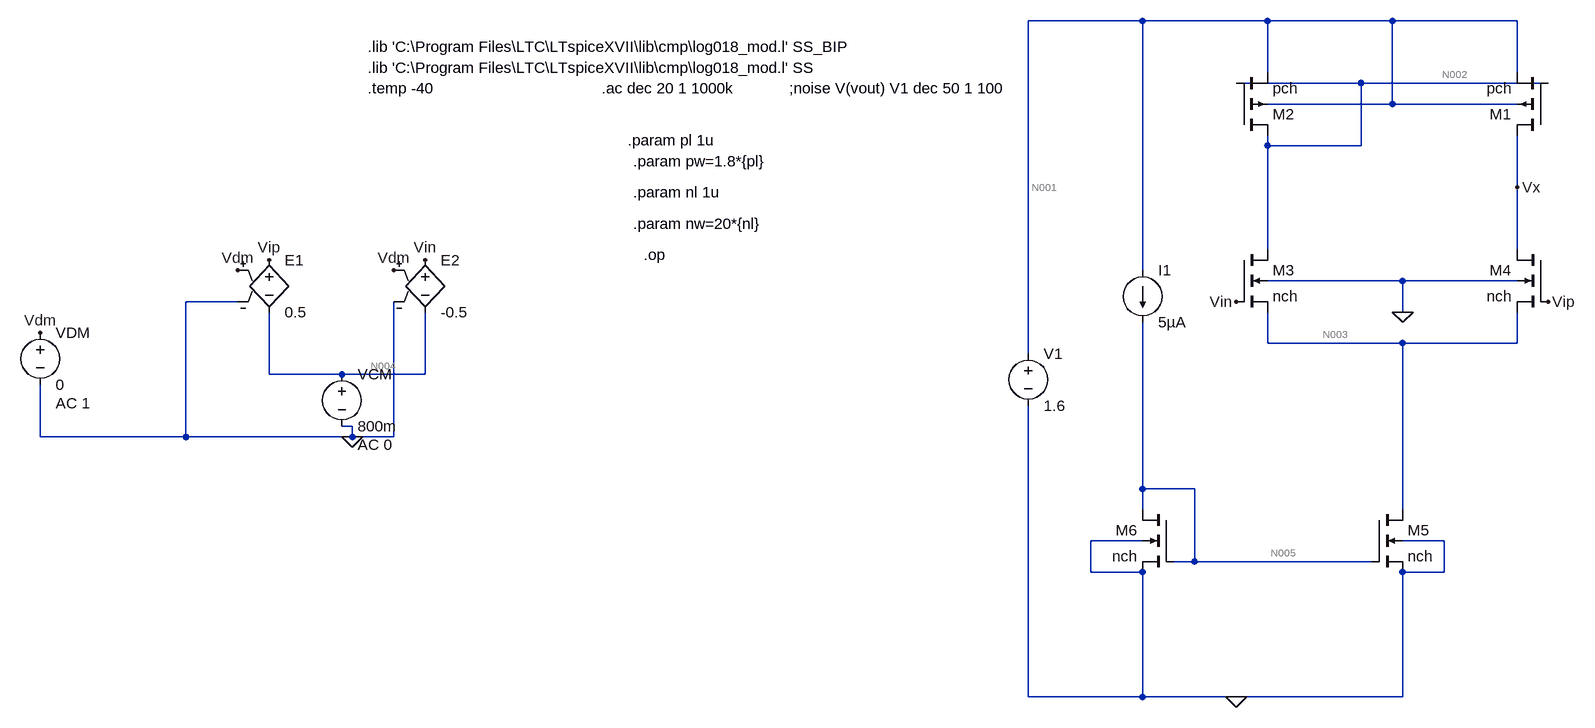
[diagram p0: schematic amplifier.asc]
amplifier.asc, the LTspice schematic file:
Version 4
SHEET 1 1880 836
WIRE -144 -224 -320 -224
WIRE 48 -224 -144 -224
WIRE 240 -224 48 -224
WIRE 432 -224 240 -224
WIRE 48 -144 48 -224
WIRE 432 -144 432 -224
WIRE 192 -128 0 -128
WIRE 480 -128 192 -128
WIRE 240 -96 240 -224
WIRE 240 -96 48 -96
WIRE 432 -96 240 -96
WIRE 48 -32 48 -48
WIRE 192 -32 192 -128
WIRE 192 -32 48 -32
WIRE 432 32 432 -48
WIRE 48 128 48 -32
WIRE 432 128 432 32
WIRE -144 160 -144 -224
WIRE 256 176 48 176
WIRE 432 176 256 176
WIRE -1536 208 -1616 208
WIRE 256 224 256 176
WIRE 48 272 48 224
WIRE 256 272 48 272
WIRE 432 272 432 224
WIRE 432 272 256 272
WIRE -320 288 -320 -224
WIRE -1488 320 -1488 224
WIRE -1376 320 -1488 320
WIRE -1248 320 -1248 224
WIRE -1248 320 -1376 320
WIRE -1360 400 -1376 400
WIRE -1840 416 -1840 336
WIRE -1616 416 -1616 208
WIRE -1616 416 -1840 416
WIRE -1360 416 -1360 400
WIRE -1360 416 -1616 416
WIRE -1296 416 -1296 208
WIRE -1296 416 -1360 416
WIRE -144 496 -144 240
WIRE -64 496 -144 496
WIRE -144 528 -144 496
WIRE 256 528 256 272
WIRE -144 576 -224 576
WIRE 320 576 256 576
WIRE -64 608 -64 496
WIRE -64 608 -96 608
WIRE 208 608 -64 608
WIRE -224 624 -224 576
WIRE -144 624 -224 624
WIRE 320 624 320 576
WIRE 320 624 256 624
WIRE -320 816 -320 368
WIRE -144 816 -144 624
WIRE -144 816 -320 816
WIRE 0 816 -144 816
WIRE 256 816 256 624
WIRE 256 816 0 816
FLAG 256 224 0
FLAG 0 208 Vin
FLAG 480 208 Vip
FLAG 0 816 0
FLAG -1360 416 0
FLAG 432 32 Vx
FLAG -1488 144 Vip
FLAG -1248 144 Vin
FLAG -1840 256 Vdm
FLAG -1536 160 Vdm
FLAG -1296 160 Vdm
SYMBOL nmos4 0 128 R0
SYMATTR InstName M3
SYMATTR Value2 l={nl} w={nw}
SYMATTR Value nch
SYMBOL nmos4 480 128 M0
SYMATTR InstName M4
SYMATTR Value2 l={nl} w={nw}
SYMATTR Value nch
SYMBOL nmos4 208 528 R0
SYMATTR InstName M5
SYMATTR Value2 l={nl} w={nw}
SYMATTR Value nch
SYMBOL nmos4 -96 528 M0
SYMATTR InstName M6
SYMATTR Value2 l={nl} w={nw}
SYMATTR Value nch
SYMBOL current -144 160 R0
WINDOW 123 0 0 Left 0
WINDOW 39 0 0 Left 0
SYMATTR InstName I1
SYMATTR Value 5µA
SYMBOL voltage -320 272 R0
WINDOW 123 0 0 Left 0
WINDOW 39 0 0 Left 0
SYMATTR InstName V1
SYMATTR Value 1.6
SYMBOL voltage -1376 304 R0
WINDOW 123 24 124 Left 2
WINDOW 39 0 0 Left 0
SYMATTR Value2 AC 0
SYMATTR InstName VCM
SYMATTR Value 800m
SYMBOL e -1488 128 R0
SYMATTR InstName E1
SYMATTR Value 0.5
SYMBOL e -1248 128 R0
SYMATTR InstName E2
SYMATTR Value -0.5
SYMBOL voltage -1840 240 R0
WINDOW 123 24 124 Left 2
WINDOW 39 0 0 Left 0
SYMATTR Value2 AC 1
SYMATTR InstName VDM
SYMATTR Value 0
SYMBOL pmos4 480 -48 R180
SYMATTR InstName M1
SYMATTR Value2 l={pl} w={pw}
SYMATTR Value pch
SYMBOL pmos4 0 -48 M180
SYMATTR InstName M2
SYMATTR Value2 l={pl} w={pw}
SYMATTR Value pch
TEXT -1336 -120 Left 2 !.temp -40
TEXT -1336 -152 Left 2 !.lib 'C:\\Program Files\\LTC\\LTspiceXVII\\lib\\cmp\\log018_mod.l' SS
TEXT -1336 -184 Left 2 !.lib 'C:\\Program Files\\LTC\\LTspiceXVII\\lib\\cmp\\log018_mod.l' SS_BIP
TEXT -976 -120 Left 2 !.ac dec 20 1 1000k
TEXT -688 -120 Left 2 !;noise V(vout) V1 dec 50 1 100
TEXT -936 -40 Left 2 !.param pl 1u
TEXT -928 -8 Left 2 !.param pw=1.8*{pl}
TEXT -928 40 Left 2 !.param nl 1u
TEXT -928 88 Left 2 !.param nw=20*{nl}
TEXT -912 136 Left 2 !.op

The netlist it stands for:
* amplifier.asc
M3 N002 Vin N003 0 nch l={nl} w={nw}
M4 Vx Vip N003 0 nch l={nl} w={nw}
M5 N003 N005 0 0 nch l={nl} w={nw}
M6 N005 N005 0 0 nch l={nl} w={nw}
I1 N001 N005 5µA
V1 N001 0 1.6
VCM N004 0 800m AC 0
E1 Vip N004 Vdm 0 0.5
E2 Vin N004 Vdm 0 -0.5
VDM Vdm 0 0 AC 1
M1 Vx N002 N001 N001 pch l={pl} w={pw}
M2 N002 N002 N001 N001 pch l={pl} w={pw}
.model NMOS NMOS
.model PMOS PMOS
.lib standard.mos
.temp -40
.lib 'C:\Program Files\LTC\LTspiceXVII\lib\cmp\log018_mod.l' SS
.lib 'C:\Program Files\LTC\LTspiceXVII\lib\cmp\log018_mod.l' SS_BIP
.ac dec 20 1 1000k
;noise V(vout) V1 dec 50 1 100
.param pl 1u
.param pw=1.8*{pl}
.param nl 1u
.param nw=20*{nl}
.op
.backanno
.end

* Results of the author's LTspice run, read from the files saved beside the schematic
* Operating Point, zero values left out:
*   V(n002) = 836.7 mV
*   V(vin) = 800 mV
*   V(n003) = 195.6 mV
*   V(vx) = 836.7 mV
*   V(vip) = 800 mV
*   V(n005) = 582 mV
*   V(n001) = 1.6 V
*   V(n004) = 800 mV
*   Id(M2) = -2.386 µA
*   Is(M2) = 2.386 µA
*   Id(M1) = -2.386 µA
*   Is(M1) = 2.386 µA
*   Id(M6) = 5 µA
*   Is(M6) = -5 µA
*   Id(M5) = 4.771 µA
*   Is(M5) = -4.771 µA
*   Id(M4) = 2.386 µA
*   Ib(M4) = -1.055 pA
*   Is(M4) = -2.386 µA
*   Id(M3) = 2.386 µA
*   Ib(M3) = -1.055 pA
*   Is(M3) = -2.386 µA
*   I(I1) = 5 µA
*   I(V1) = -9.771 µA
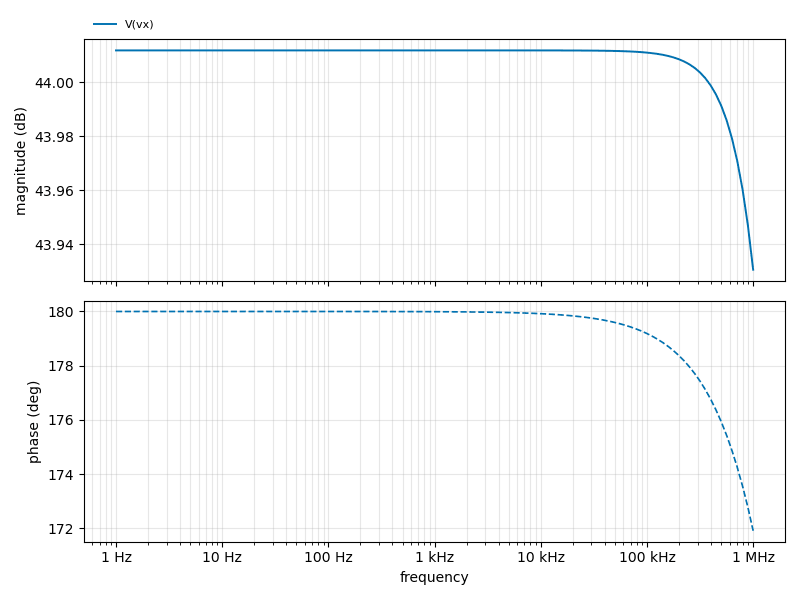
[diagram p1: AC Analysis of amplifier.asc, plotted from the saved traces]
* AC Analysis, 1 run:
*   V(vx): 44.01 dB at 1 Hz, 43.93 dB at 1 MHz, peak 44.01 dB at 1 Hz
* From the log:
*   Semiconductor Device Operating Points:
*                           --- BSIM3 MOSFETS ---
*   Name:        m2          m1          m6          m5          m4
*   Model:      pch.5       pch.5       nch.2       nch.2       nch.2
*   Id:       -2.39e-06   -2.39e-06    5.00e-06    4.77e-06    2.39e-06
*   Vgs:      -7.63e-01   -7.63e-01    5.82e-01    5.82e-01    6.04e-01
*   Vds:      -7.63e-01   -7.63e-01    5.82e-01    1.96e-01    6.41e-01
*   Vbs:       0.00e+00    0.00e+00    0.00e+00    0.00e+00   -1.96e-01
*   Vth:      -5.73e-01   -5.73e-01    6.30e-01    6.31e-01    6.83e-01
*   Vdsat:    -1.78e-01   -1.78e-01    5.18e-02    5.18e-02    4.59e-02
*   Gm:        2.16e-05    2.16e-05    1.16e-04    1.12e-04    5.79e-05
*   Gds:       1.10e-07    1.10e-07    4.99e-07    9.31e-07    2.54e-07
*   Gmb        7.07e-06    7.07e-06    3.37e-05    3.23e-05    1.52e-05
*   Cbd:       0.00e+00    0.00e+00    0.00e+00    0.00e+00    0.00e+00
*   Cbs:       0.00e+00    0.00e+00    0.00e+00    0.00e+00    0.00e+00
*   Cgsov:     5.52e-16    5.52e-16    6.96e-15    6.96e-15    6.96e-15
*   Cgdov:     5.52e-16    5.52e-16    6.96e-15    6.96e-15    6.96e-15
*   Cgbov:     2.64e-16    2.64e-16    1.76e-16    1.76e-16    1.76e-16
*   dQgdVgb:   1.22e-14    1.22e-14    5.67e-14    5.67e-14    4.89e-14
*   dQgdVdb:  -5.52e-16   -5.52e-16   -6.96e-15   -6.97e-15   -6.96e-15
*   dQgdVsb:  -1.07e-14   -1.07e-14   -1.75e-14   -1.75e-14   -1.06e-14
*   dQddVgb:  -5.66e-16   -5.66e-16   -6.97e-15   -7.09e-15   -6.96e-15
*   dQddVdb:   5.57e-16    5.57e-16    6.96e-15    6.99e-15    6.96e-15
*   dQddVsb:   1.38e-17    1.38e-17    2.17e-17    1.42e-16    5.95e-18
*   dQbdVgb:  -2.00e-15   -2.00e-15   -3.16e-14   -3.16e-14   -3.12e-14
*   dQbdVdb:  -1.13e-18   -1.13e-18    4.39e-19   -4.41e-18    1.46e-19
*   dQbdVsb:  -1.79e-15   -1.79e-15   -3.86e-15   -3.87e-15   -1.07e-15
*   Name:        m3
*   Model:      nch.2
*   Id:        2.39e-06
*   Vgs:       6.04e-01
*   Vds:       6.41e-01
*   Vbs:      -1.96e-01
*   Vth:       6.83e-01
*   Vdsat:     4.59e-02
*   Gm:        5.79e-05
*   Gds:       2.54e-07
*   Gmb        1.52e-05
*   Cbd:       0.00e+00
*   Cbs:       0.00e+00
*   Cgsov:     6.96e-15
*   Cgdov:     6.96e-15
*   Cgbov:     1.76e-16
*   dQgdVgb:   4.89e-14
*   dQgdVdb:  -6.96e-15
*   dQgdVsb:  -1.06e-14
*   dQddVgb:  -6.96e-15
*   dQddVdb:   6.96e-15
*   dQddVsb:   5.95e-18
*   dQbdVgb:  -3.12e-14
*   dQbdVdb:   1.46e-19
*   dQbdVsb:  -1.07e-15